# Altium schematic sheet Encoder_Sheet.SchDoc
size A
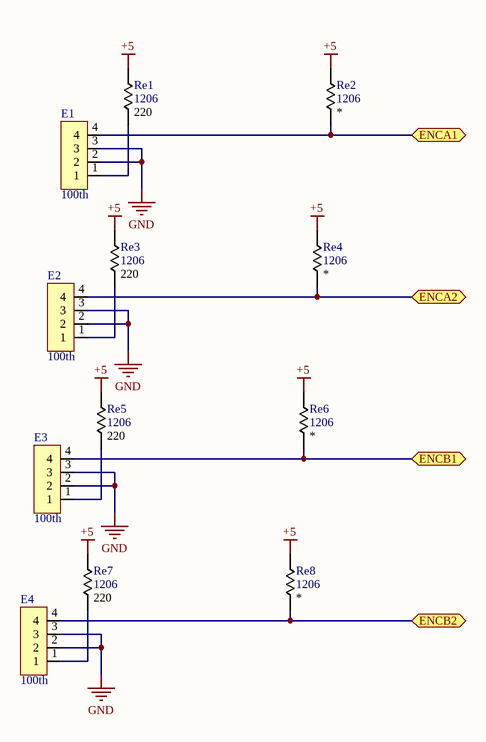
[diagram p0: Encoder_Sheet.SchDoc]

## Parts
E1  100th  [pin4header]
E2  100th  [pin4header]
E3  100th  [pin4header]
E4  100th  [pin4header]
Re1  1206  value 220  [1206]
Re2  1206  [1206]
Re3  1206  value 220  [1206]
Re4  1206  [1206]
Re5  1206  value 220  [1206]
Re6  1206  [1206]
Re7  1206  value 220  [1206]
Re8  1206  [1206]

## Ports
ENCA1 (bidir), ENCA2 (bidir), ENCB1 (bidir), ENCB2 (bidir)

## Nets
+5: Re1.2 Re2.2 Re3.2 Re4.2 Re5.2 Re6.2 Re7.2 Re8.2
GND: E1.2 E1.3 E2.2 E2.3 E3.2 E3.3 E4.2 E4.3
ENCA1: E1.4 Re2.1 ; port ENCA1
ENCA2: E2.4 Re4.1 ; port ENCA2
ENCB1: E3.4 Re6.1 ; port ENCB1
ENCB2: E4.4 Re8.1 ; port ENCB2
NetE1_1: E1.1 Re1.1
NetE2_1: E2.1 Re3.1
NetE3_1: E3.1 Re5.1
NetE4_1: E4.1 Re7.1

## Library data of the parts
E1-E4 = Pin4Header
Re1-Re8 = 1206
  Re2 Re4 Re6 Re8: Value: *